# EAGLE schematic Yahoo5NewsViewWtithWeather (EAGLE 8.4.1)
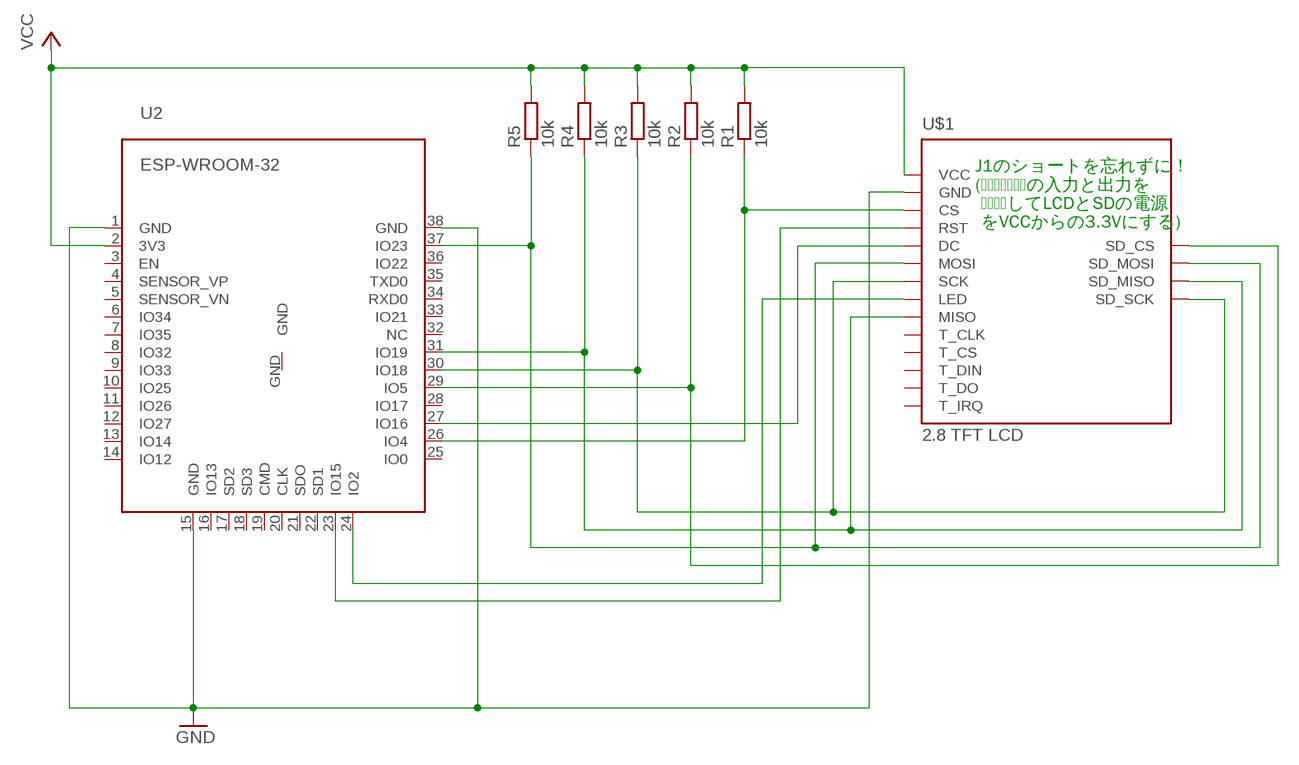
[diagram p0: schematic, sheet 1]

## Parts
R1  10k  R-EU_0204/5  [0204/5]
R2  10k  R-EU_0204/5  [0204/5]
R3  10k  R-EU_0204/5  [0204/5]
R4  10k  R-EU_0204/5  [0204/5]
R5  10k  R-EU_0204/5  [0204/5]
U2  ESP-WROOM-32  [ESP-WROOM-32]
U$1  2.8_TFT_LCD  [2.8_TFT_LCD]

## Nets
GND: U2.1(GND) U2.15(GND) U2.38(GND) U$1.GND
N$1: R1.1 U2.26(IO4) U$1.CS
N$2: U2.23(IO15) U$1.RST
N$3: U2.27(IO16) U$1.DC
N$5: R3.1 U2.30(IO18) U$1.SCK U$1.SD_SCK
N$6: R5.1 U2.37(IO23) U$1.MOSI U$1.SD_MOSI
N$7: U2.24(IO2) U$1.LED
N$8: R4.1 U2.31(IO19) U$1.MISO U$1.SD_MISO
N$10: R2.1 U2.29(IO5) U$1.SD_CS
VCC: R1.2 R2.2 R3.2 R4.2 R5.2 U2.2(3V3) U$1.VCC
Unconnected: U2.3(EN) U2.4(SENSOR_VP) U2.5(SENSOR_VN) U2.6(IO34) U2.7(IO35) U2.8(IO32) U2.9(IO33) U2.10(IO25) U2.11(IO26) U2.12(IO27) U2.13(IO14) U2.14(IO12) U2.16(IO13) U2.17(SD2) U2.18(SD3) U2.19(CMD) U2.20(CLK) U2.21(SDO) U2.22(SD1) U2.25(IO0) U2.28(IO17) U2.32(NC) U2.33(IO21) U2.34(RXD0) U2.35(TXD0) U2.36(IO22) U2.GND U$1.T_CLK U$1.T_CS U$1.T_DIN U$1.T_DO U$1.T_IRQ

## Notes on the sheet
- J1のショートを忘れずに！
  (ﾚｷﾞｭﾚｰﾀの入力と出力を
   ｼｮｰﾄしてLCDとSDの電源
   をVCCからの3.3Vにする)

## Library data of the parts
R1-R5 = resistor:R-EU_: RESISTOR, European symbol
U2 = esp32 (1):ESP-WROOM-32
U$1 = Aldar:2.8_TFT_LCD